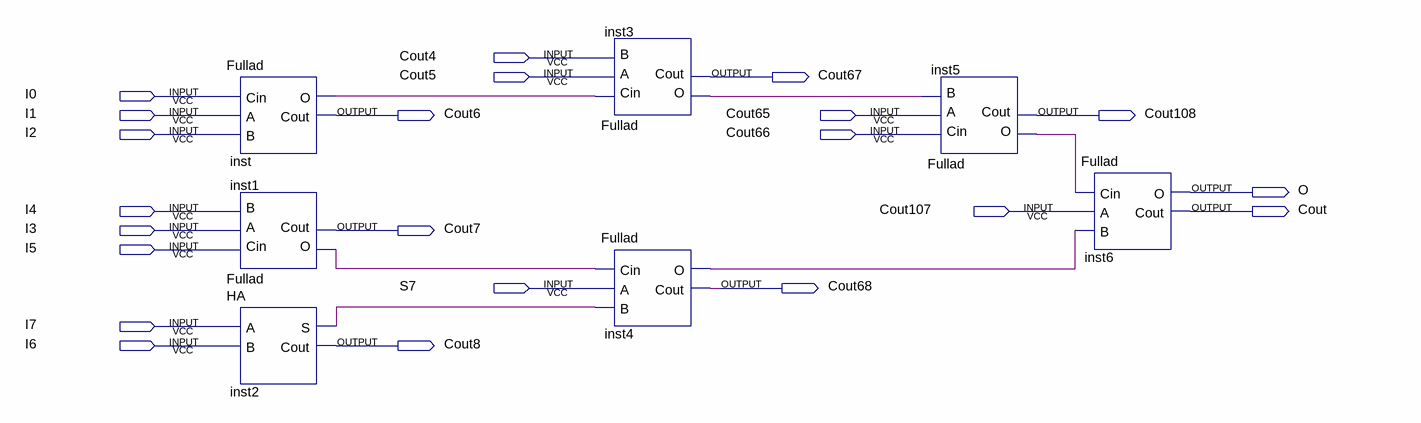
[diagram p0: schematic sheet]
// Quartus schematic B14.bdf as structural Verilog: 7 symbols, 22 pins
module B14 (
  input  Cout4,
  input  Cout5,
  input  I0,
  input  I1,
  input  Cout65,
  input  I2,
  input  Cout66,
  input  I4,
  input  Cout107,
  input  I3,
  input  I5,
  input  S7,
  input  I7,
  input  I6,
  output Cout67,
  output Cout6,
  output Cout108,
  output O,
  output Cout,
  output Cout7,
  output Cout68,
  output Cout8
);

  wire inst1_o, inst2_s, inst3_o, inst4_o, inst5_o, inst_o;

  Fullad inst (.Cin(I0), .A(I1), .B(I2), .O(inst_o), .Cout(Cout6));
  Fullad inst1 (.Cin(I5), .A(I3), .B(I4), .O(inst1_o), .Cout(Cout7));
  HA inst2 (.A(I7), .B(I6), .S(inst2_s), .Cout(Cout8));
  Fullad inst3 (.Cin(inst_o), .A(Cout5), .B(Cout4), .O(inst3_o), .Cout(Cout67));
  Fullad inst4 (.Cin(inst1_o), .A(S7), .B(inst2_s), .O(inst4_o), .Cout(Cout68));
  Fullad inst5 (.Cin(Cout66), .A(Cout65), .B(inst3_o), .O(inst5_o), .Cout(Cout108));
  Fullad inst6 (.Cin(inst5_o), .A(Cout107), .B(inst4_o), .O(O), .Cout(Cout));
endmodule
